# EasyEDA Pro project artisansTomePcb.eprj

# Schematic Schematic1
Create Date: 2025-06-08; Page Name: P1; Project Name: weather; Schematic Name: Schematic1; Update Date: 2025-09-30; Company: 嘉立创EDA; Page Size: A4; Version: V1.0
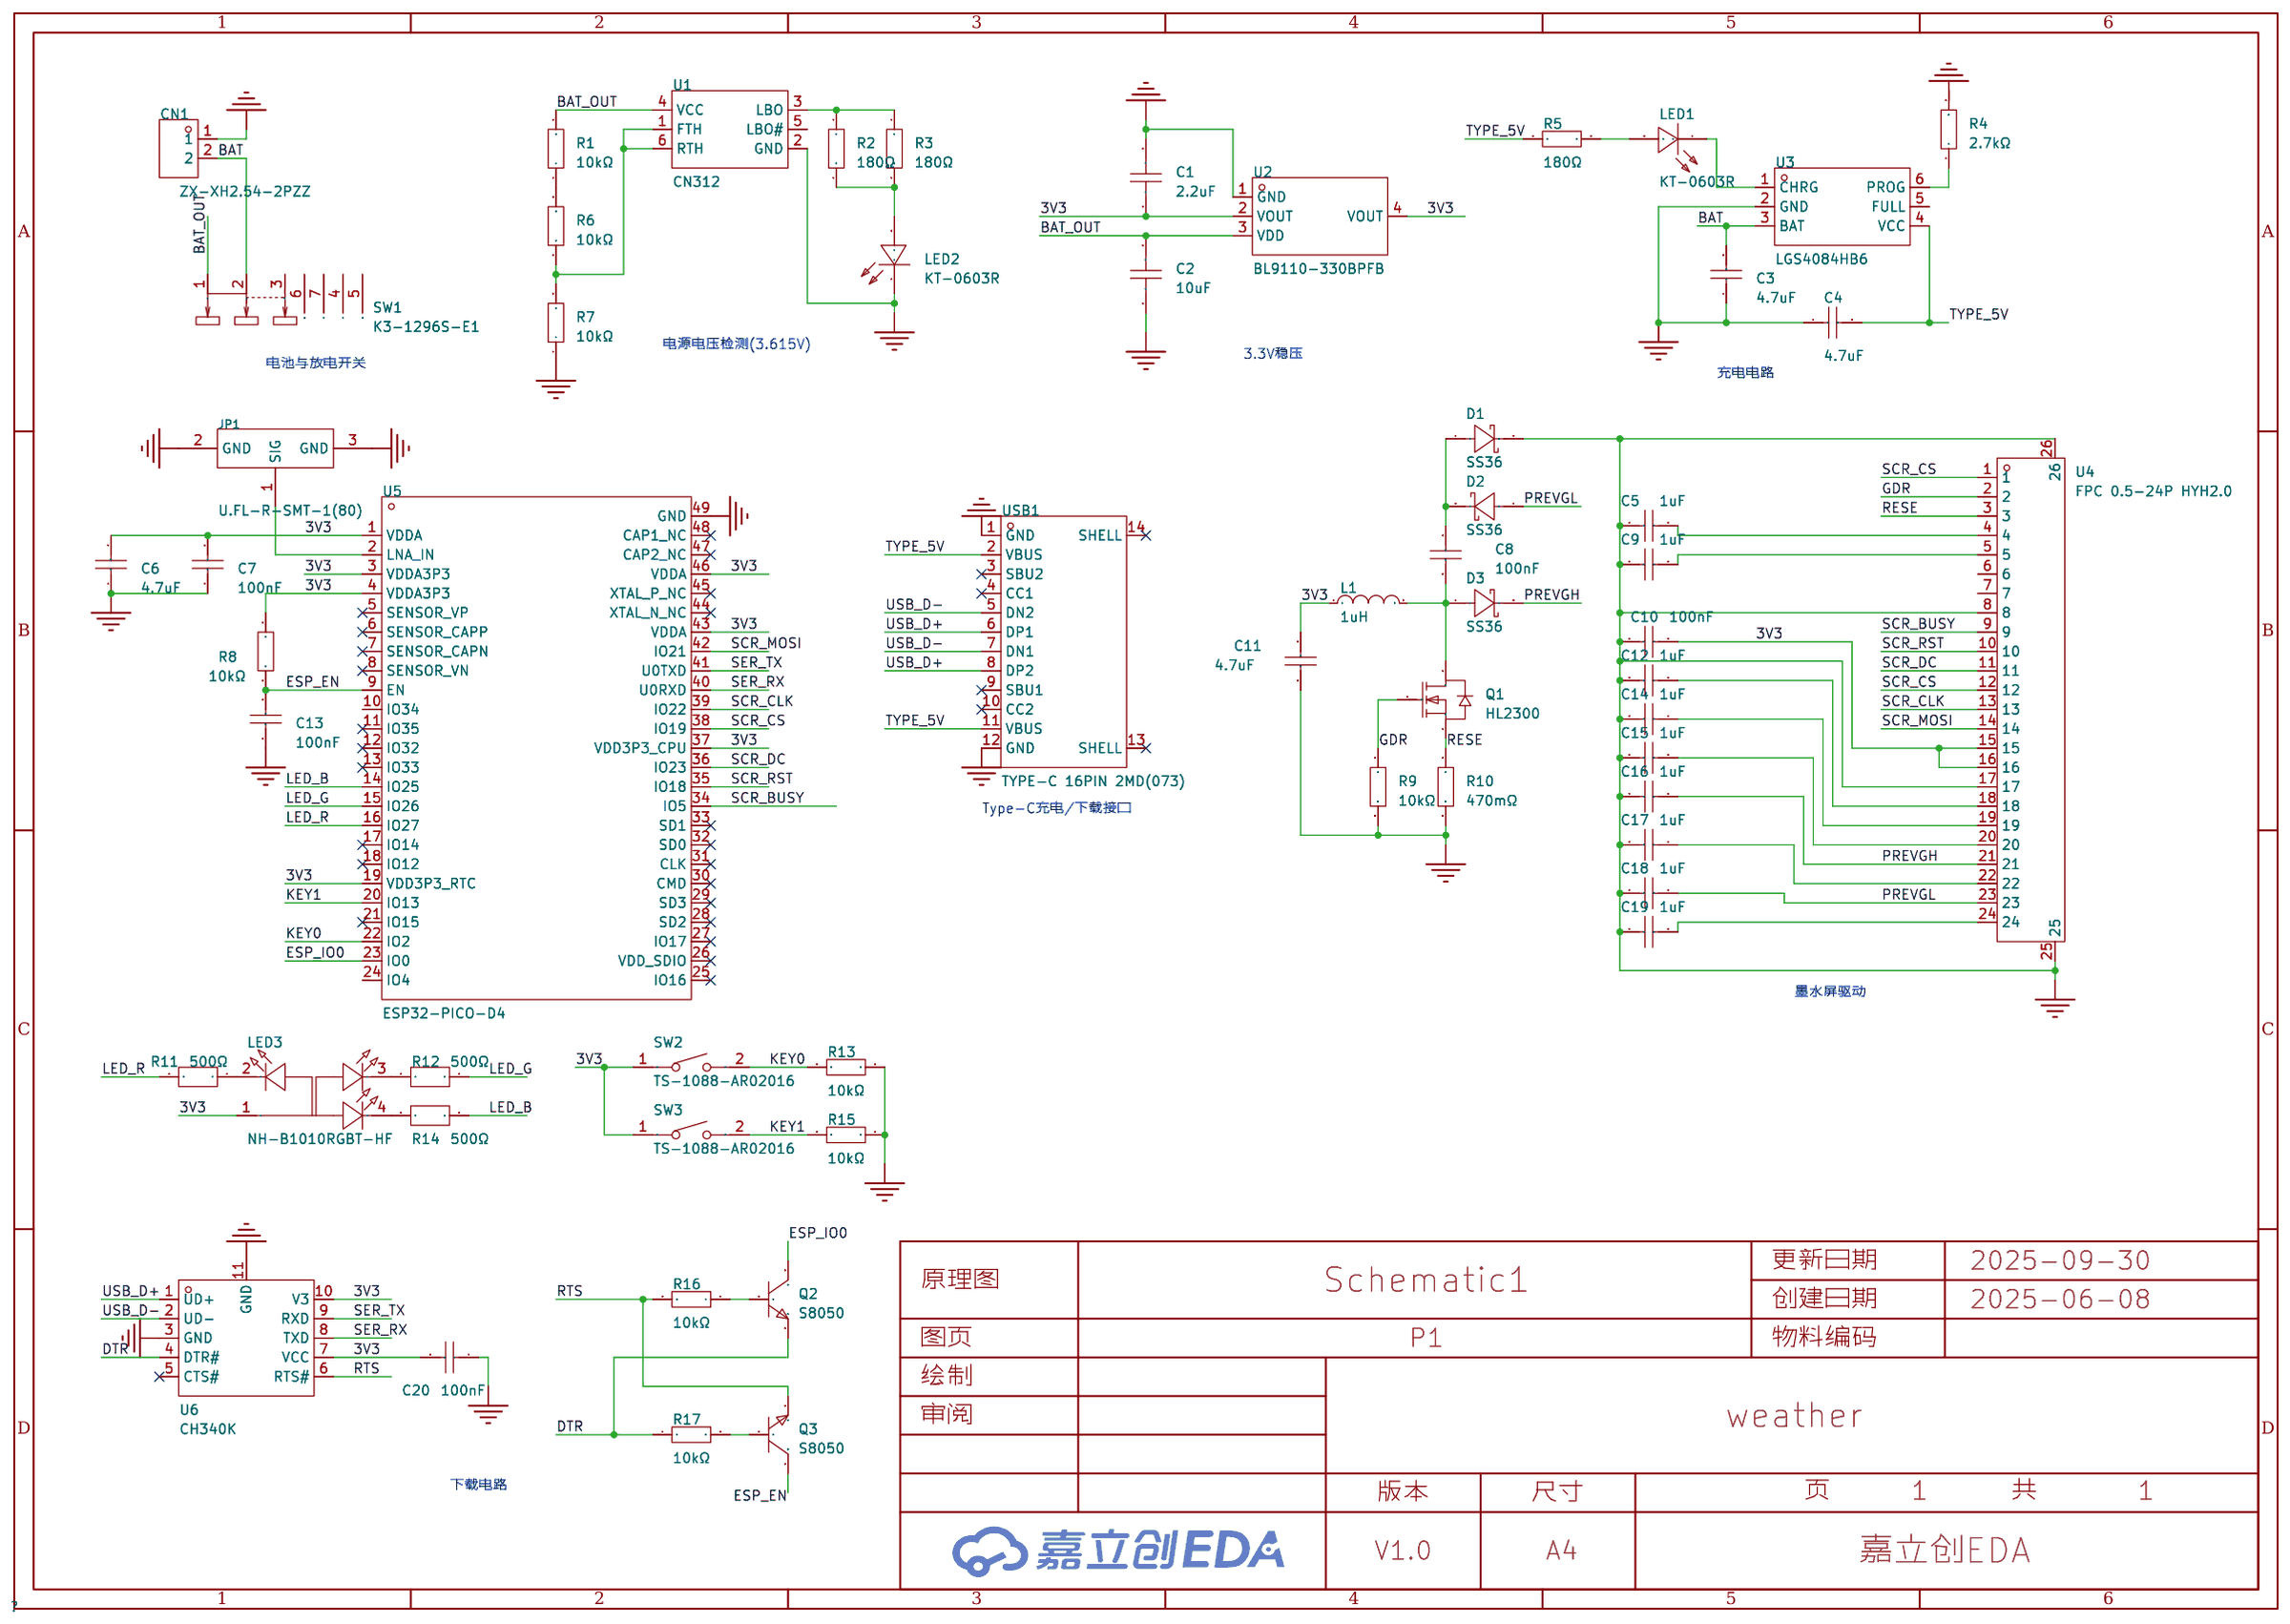
[diagram p0: schematic sheet]

## Parts
C1  2.2uF  [C0402]
C2  10uF  [C0402]
C3  4.7uF  [C0402]
C4  4.7uF  [C0402]
C5  1uF  [C0402]
C6  4.7uF  [C0402]
C7  100nF  [C0402]
C8  100nF  [C0402]
C9  1uF  [C0402]
C10  100nF  [C0402]
C11  4.7uF  [C0402]
C12  1uF  [C0402]
C13  100nF  [C0402]
C14  1uF  [C0402]
C15  1uF  [C0402]
C16  1uF  [C0402]
C17  1uF  [C0402]
C18  1uF  [C0402]
C19  1uF  [C0402]
C20  100nF  [C0402]
CN1  ZX-XH2.54-2PZZ  [CONN-TH_2P-P2.50_HX25003-2A]
D1  SS36  [DO-214AC_L5.0-W2.5-LS5.0-FD]
D2  SS36  [DO-214AC_L5.0-W2.5-LS5.0-FD]
D3  SS36  [DO-214AC_L5.0-W2.5-LS5.0-FD]
JP1  U.FL-R-SMT-1(80)  [RF-SMD_FRF05002-JSS103M]
L1  1uH  [IND-SMD_L2.0-W1.6-B]
LED1  KT-0603R  [LED0603-RD]
LED2  KT-0603R  [LED0603-RD]
LED3  NH-B1010RGBT-HF  [LED-ARRAY-SMD_4P-L1.0-W1.0-TR_NH-B1010RGBT]
Q1  HL2300  [SOT-23-3_L2.9-W1.3-P1.90-LS2.4-BR]
Q2  S8050  [SOT-23-3_L2.9-W1.6-P1.90-LS2.8-BR]
Q3  S8050  [SOT-23-3_L2.9-W1.6-P1.90-LS2.8-BR]
R1  10kΩ  [R0402]
R2  180Ω  [R0402]
R3  180Ω  [R0402]
R4  2.7kΩ  [R0402]
R5  180Ω  [R0402]
R6  10kΩ  [R0402]
R7  10kΩ  [R0402]
R8  10kΩ  [R0402]
R9  10kΩ  [R0402]
R10  470mΩ  [R0402]
R11  500Ω  [R0402]
R12  500Ω  [R0402]
R13  10kΩ  [R0402]
R14  500Ω  [R0402]
R15  10kΩ  [R0402]
R16  10kΩ  [R0402]
R17  10kΩ  [R0402]
SW1  K3-1296S-E1  [SW-TH_K3-1296S-E1]
SW2  TS-1088-AR02016  [SW-SMD_L3.9-W3.0-P4.45]
SW3  TS-1088-AR02016  [SW-SMD_L3.9-W3.0-P4.45]
U1  CN312  [SOT-23-6_L2.9-W1.6-P0.95-LS2.8-BL]
U2  BL9110-330BPFB  [SOT-223_L6.5-W3.5-P2.30-LS7.0-BR]
U3  LGS4084HB6  [SOT-23-6_L2.9-W1.6-P0.95-LS2.8-BL]
U4  FPC 0.5-24P HYH2.0  [FPC-SMD_24P-P0.50_FPC-0.5-24P-HYH2.0]
U5  ESP32-PICO-D4  [ESP32-PICO-D4_lengthen]
U6  CH340K  [ESOP-10_L4.9-W3.9-P1.00-LS6.0-BL-EP]
USB1  TYPE-C 16PIN 2MD(073)  [USB-C-SMD_TYPE-C-6PIN-2MD-073]

## Library data of the parts
C1 = HGC0402R5225K160NTEJ: 容值:2.2uF;精度:±10%;额定电压:16V;材质(温度系数):X5R;; LCSC Part Name: 2.2uF ±10% 16V; Supplier Part: C7432763; Manufacturer: Chinocera(华瓷); Supplier Footprint: 0402; JLCPCB Part Class: Extended Part; Datasheet: https://atta.szlcsc.com/upload/public/pdf/source/20240320/FAC3FEC40A78BC5CCCE96C232A94D860.pdf; Supplier: LCSC; Tolerance: ±10%; Voltage Rated: 16V; Temperature Coefficient: X5R
C2 = CGA0402X5R106M100GT: 容值:10uF;精度:±20%;额定电压:10V;材质(温度系数):X5R;; LCSC Part Name: 10uF ±20% 10V; Supplier Part: C6119763; Manufacturer: HRE(芯声); Supplier Footprint: 0402; JLCPCB Part Class: Extended Part; Supplier: LCSC; Tolerance: ±20%; Voltage Rated: 10V; Temperature Coefficient: X5R
C3 C4 C6 = CL05A106MQ5NUNC: 容值:10uF;精度:±20%;额定电压:6.3V;材质(温度系数):X5R;; LCSC Part Name: 10uF ±20% 6.3V; Supplier Part: C23733; Manufacturer: SAMSUNG(三星); Manufacturer Part: CL05A475MP5NRNC; Supplier Footprint: 0402; JLCPCB Part Class: Basic Part; Datasheet: https://atta.szlcsc.com/upload/public/pdf/source/20220823/2B02EE04F8F211D38A52DCB16EB6BEBA.pdf; Supplier: LCSC; Tolerance: ±20%; Voltage Rated: 6.3V; Temperature Coefficient: X5R
C5 C9 C12 C14-C19 = CL05A105KP5NNNC: 容值:1uF;精度:±10%;额定电压:10V;温度系数:X5R;; LCSC Part Name: 1uF ±10% 10V; Supplier Part: C14445; Manufacturer: SAMSUNG(三星); Manufacturer Part: CL05A106MQ5NUNC; Supplier Footprint: 0402; JLCPCB Part Class: Basic Part; Datasheet: https://item.szlcsc.com/datasheet/CL05A105KP5NNNC/15107.html; Supplier: LCSC; Tolerance: ±10%; Voltage Rating: 10V; Temperature Coefficient: X5R; Voltage Rated: 6.3V
C7 C10 C13 C20 = CL05B104KO5NNNC: 容值:100nF;精度:±10%;额定电压:16V;材质(温度系数):X7R;; LCSC Part Name: 100nF ±10% 16V; Supplier Part: C1525; Manufacturer: SAMSUNG(三星); Supplier Footprint: 0402; JLCPCB Part Class: Basic Part; Datasheet: https://atta.szlcsc.com/upload/public/pdf/source/20160218/1457707763339.pdf; Supplier: LCSC; Tolerance: ±10%; Voltage Rated: 16V; Temperature Coefficient: X7R
C8 = CL05B104KO5NNNC: 容值:100nF;精度:±10%;额定电压:16V;温度系数:X7R;; LCSC Part Name: 100nF ±10% 16V; Supplier Part: C1525; Manufacturer: SAMSUNG(三星); Manufacturer Part: CL05A106MQ5NUNC; Supplier Footprint: 0402; JLCPCB Part Class: Basic Part; Datasheet: https://item.szlcsc.com/datasheet/CL05B104KO5NNNC/1877.html; Supplier: LCSC; Tolerance: ±10%; Voltage Rated: 6.3V; Temperature Coefficient: X7R; Voltage Rating: 16V
C11 = CL05A475MP5NRNC: 容值:4.7uF;精度:±20%;额定电压:10V;温度系数:X5R;; LCSC Part Name: 4.7uF ±20% 10V; Supplier Part: C23733; Manufacturer: SAMSUNG(三星); Supplier Footprint: 0402; JLCPCB Part Class: Basic Part; Datasheet: https://item.szlcsc.com/datasheet/CL05A475MP5NRNC/24469.html; Supplier: LCSC; Tolerance: ±20%; Voltage Rating: 10V; Temperature Coefficient: X5R; Voltage Rated: 6.3V
CN1 = ZX-XH2.54-2PZZ: 插针结构:1x2P;间距:2.54mm;安装方式:直插;参考系列:XH;总PIN数:2P;排数:1;每排PIN数:2;行距:-;额定电流:3A;触头材质:黄铜;触头镀层:锡;工作温度范围:-25℃~+85℃;; Supplier Part: C7429632; Manufacturer: Megastar(兆星); Supplier Footprint: 插件,P=2.54mm; JLCPCB Part Class: Extended Part; Datasheet: https://atta.szlcsc.com/upload/public/pdf/source/20230619/19BA6947230AA44A04D3EDD65E618FD0.pdf; Supplier: LCSC; Pins Structure: 1x2P; Pitch: 2.54mm; Mounting Style: 直插; Reference Series: XH; Number of Pins: 2P; Number of Rows: 1; Number of PINs Per Row: 2; Current Rating (Max): 3A; Contact Material: 黄铜; Contact Plating: 锡; Operating Temperature Range: -25℃~+85℃
D1-D3 = SS36_C7420367: 二极管配置:独立式;正向压降(Vf):700mV@3.0A;直流反向耐压(Vr):60V;整流电流:3A;; LCSC Part Name: 电压:60V 电流:3A; Supplier Part: C7420367; Manufacturer: R+O(宏嘉诚); Supplier Footprint: SMA(DO-214AC); JLCPCB Part Class: Extended Part; Datasheet: https://item.szlcsc.com/datasheet/SS36/8397189.html; Supplier: LCSC; Diode Configuration: 独立式; Forward Voltage (Vf@If): 700mV@3.0A; Reverse Voltage (Vr): 60V; Rectified Current: 3A; Reverse Leakage Current (Ir): 10mA@60V; Voltage - Forward(Vf@If): 700mV@3.0A; Voltage - DC Reverse(Vr): 60V; Current - Rectified: 3A; Operating Junction Temperature Range: -55℃~+150℃; Non-Repetitive Peak Forward Surge Current: 80A
JP1 = U.FL-R-SMT-1(80)_C88374: 连接器类型:板端;接口类型:内针;端口数量:1;接口直径:2mm;接口长度/高度:1.25mm;频率-最大值:6GHz;射频系列:IPEX;阻抗:50Ω;样式:-;触头材质:黄铜;工作温度范围:-40℃~+90℃;; LCSC Part Name: IPEX 内针; Supplier Part: C88374; Manufacturer: HRS(广濑); Supplier Footprint: SMD; JLCPCB Part Class: Extended Part; Datasheet: https://atta.szlcsc.com/upload/public/pdf/source/20161125/1480067868647.pdf; Supplier: LCSC; Connector Type: 板端; Interface Type: 内针; Number of Ports: 1; Interface Diameter: 2mm; Interface Length/Height: 1.25mm; Frequency-Max: 6GHz; RF Series: IPEX; Impedance: 50Ω; Contact Material: 黄铜; Operating Temperature Range: -40℃~+90℃
L1 = FTC201610S1R0MBCA: 电感值:1uH;精度:±20%;额定电流:4.5A;饱和电流(Isat):4.6A;类型:一体成型电感;; LCSC Part Name: 1uH ±20% 4.6A; Supplier Part: C5832342; Manufacturer: cjiang(长江微电); Supplier Footprint: SMD,1.6x2mm; JLCPCB Part Class: Extended Part; Datasheet: https://atta.szlcsc.com/upload/public/pdf/source/20230602/8FFEDA9C0247A92A0D4B67554BFE4091.pdf; Supplier: LCSC; Tolerance: ±20%; Rated Current: 4.5A; Saturation Current (Isat): 4.6A; DC Resistance (DCR): 35mΩ; Type: 一体成型电感
LED1 LED2 = KT-0603R: 发光颜色:红色;功率:-;正向电流:-;主波长:-;二极管配置:-;透镜颜色:-;色温:-;发光角度:-;载带方式:-;工作温度:-40℃~+85℃;; LCSC Part Name: 0603 红灯 高亮; Supplier Part: C2286; Manufacturer: KENTO; Supplier Footprint: 0603; JLCPCB Part Class: Basic Part; Datasheet: https://atta.szlcsc.com/upload/public/pdf/source/20160616/1466072038404.pdf; Supplier: LCSC; Emitted Color: 红色; Operating Temperature: -40℃~+85℃
LED3 = NH-B1010RGBT-HF: 户内RGB，全黑框架，对比度高，黑色哑光封装，无镜面反射; LCSC Part Name: 贴片全彩LED; Supplier Part: C2874113; Manufacturer: 国星光电; Supplier Footprint: SMD-4P,1x1mm; JLCPCB Part Class: Extended Part; Datasheet: https://item.szlcsc.com/datasheet/NH-B1010RGBT-HF/3078825.html; Supplier: LCSC; Diode Configuration: 共阳极; Wavelength - Dominant: R:620nm；G:530nm；B:470nm; Luminous Intensity: R:18mcd；G:25mcd；B:4.5mcd; Viewing Angle: 120°; Forward Current: B:2mA；G:2mA；R:5mA; Forward Voltage(Vf): R:2V；G:2.6V；B:2.7V; Installation Method: 正贴; Operating Temperature: -30℃~+85℃
Q1 = HL2300_C7420343: 数量:1个N沟道;漏源电压(Vdss):20V;连续漏极电流(Id):4.5A;导通电阻(RDS(on)):20mΩ@4.5V;耗散功率(Pd):1W;阈值电压(Vgs(th)):600mV@250uA;; LCSC Part Name: N沟道,电流:4.5A,耐压:20V; Supplier Part: C7420343; Manufacturer: R+O(宏嘉诚); Supplier Footprint: SOT-23; JLCPCB Part Class: Extended Part; Datasheet: https://item.szlcsc.com/datasheet/HL2300/8397165.html; Supplier: LCSC; Number: 1个N沟道; Drain to Source Voltage: 20V; Current - Continuous Drain(Id): 4.5A; RDS(on): 20mΩ@4.5V; Pd - Power Dissipation: 1W; Gate Threshold Voltage (Vgs(th)): 600mV@250uA; Gate Charge(Qg): 6.06nC@4.5V; Input Capacitance(Ciss): 418pF; Reverse Transfer Capacitance (Crss@Vds): 70pF; Operating Temperature: -55℃~+150℃; Type: N沟道; Output Capacitance(Coss): 82pF
Q2 Q3 = S8050_C181158: 晶体管类型:NPN;集电极电流(Ic):500mA;集射极击穿电压(Vceo):25V;功率(Pd):300mW;; LCSC Part Name: NPN 电流:500mA 耐压:25V; Supplier Part: C181158; Manufacturer: Hottech(合科泰); Supplier Footprint: SOT-23; JLCPCB Part Class: Extended Part; Datasheet: https://atta.szlcsc.com/upload/public/pdf/source/20220506/D987F39D56F2975D34EC7947E75C4ABC.pdf; Supplier: LCSC; Transistor Type: NPN; Collector Current (Ic): 500mA; Collector-Emitter Breakdown Voltage (Vceo): 25V; Power Dissipation (Pd): 300mW; Transition Frequency (fT): 150MHz; Collector Cut-Off Current (Icbo): 100nA; Collector-Emitter Saturation Voltage (VCE(sat)@Ic,Ib): 600mV@500mA,50mA
R1 R6 R7 = 0402WGF1003TCE: 电阻类型:厚膜电阻;阻值:100kΩ;精度:±1%;功率:62.5mW;工作电压:50V;温度系数:±100ppm/℃;; LCSC Part Name: 100kΩ ±1% 62.5mW 厚膜电阻; Supplier Part: C25744; Manufacturer: UNI-ROYAL(厚声); Manufacturer Part: 0402WGF1002TCE; Supplier Footprint: 0402; JLCPCB Part Class: Basic Part; Datasheet: https://item.szlcsc.com/datasheet/0402WGF1003TCE/26484.html; Supplier: LCSC; Type: 厚膜电阻; Tolerance: ±1%; Power(Watts): 62.5mW; Voltage-Supply(Max): 50V; Temperature Coefficient: ±100ppm/℃; Operating Temperature: -55℃~+155℃; Overload Voltage (Max): 50V; Operating Temperature Range: -55℃~+155℃
R2 R3 R5 = 0402WGF1800TCE: 电阻类型:厚膜电阻;阻值:180Ω;精度:±1%;功率:62.5mW;最大工作电压:50V;温度系数:±100ppm/℃;; LCSC Part Name: 180Ω ±1% 62.5mW 厚膜电阻; Supplier Part: C38941; Manufacturer: UNI-ROYAL(厚声); Supplier Footprint: 0402; JLCPCB Part Class: Extended Part; Datasheet: https://atta.szlcsc.com/upload/public/pdf/source/20200306/C422600_1E6D84923E4A46A82E41ADD87F860B5C.pdf; Supplier: LCSC; Type: 厚膜电阻; Tolerance: ±1%; Power(Watts): 62.5mW; Overload Voltage (Max): 50V; Temperature Coefficient: ±100ppm/℃; Operating Temperature Range: -55℃~+155℃
R4 = 0402WGF2701TCE: 电阻类型:厚膜电阻;阻值:2.7kΩ;精度:±1%;功率:62.5mW;最大工作电压:50V;温度系数:±100ppm/℃;; LCSC Part Name: 2.7kΩ ±1% 62.5mW 厚膜电阻; Supplier Part: C25885; Manufacturer: UNI-ROYAL(厚声); Supplier Footprint: 0402; JLCPCB Part Class: Extended Part; Datasheet: https://atta.szlcsc.com/upload/public/pdf/source/20200306/C422600_1E6D84923E4A46A82E41ADD87F860B5C.pdf; Supplier: LCSC; Type: 厚膜电阻; Tolerance: ±1%; Power(Watts): 62.5mW; Overload Voltage (Max): 50V; Temperature Coefficient: ±100ppm/℃; Operating Temperature Range: -55℃~+155℃
R8 R13 R15-R17 = 0402WGF1002TCE: 电阻类型:厚膜电阻;阻值:10kΩ;精度:±1%;功率:62.5mW;最大工作电压:50V;温度系数:±100ppm/℃;; LCSC Part Name: 10kΩ ±1% 62.5mW 厚膜电阻; Supplier Part: C25744; Manufacturer: UNI-ROYAL(厚声); Supplier Footprint: 0402; JLCPCB Part Class: Basic Part; Datasheet: https://atta.szlcsc.com/upload/public/pdf/source/20200306/C422600_1E6D84923E4A46A82E41ADD87F860B5C.pdf; Supplier: LCSC; Type: 厚膜电阻; Tolerance: ±1%; Power(Watts): 62.5mW; Overload Voltage (Max): 50V; Temperature Coefficient: ±100ppm/℃; Operating Temperature Range: -55℃~+155℃
R9 = 0402WGF1002TCE: 电阻类型:厚膜电阻;阻值:10kΩ;精度:±1%;功率:62.5mW;工作电压:50V;温度系数:±100ppm/℃;; LCSC Part Name: 10kΩ ±1% 62.5mW 厚膜电阻; Supplier Part: C25744; Manufacturer: UNI-ROYAL(厚声); Supplier Footprint: 0402; JLCPCB Part Class: Basic Part; Datasheet: https://item.szlcsc.com/datasheet/0402WGF1002TCE/26487.html; Supplier: LCSC; Type: 厚膜电阻; Tolerance: ±1%; Power(Watts): 62.5mW; Overload Voltage (Max): 50V; Temperature Coefficient: ±100ppm/℃; Operating Temperature Range: -55℃~+155℃; Voltage-Supply(Max): 50V; Operating Temperature: -55℃~+155℃
R10 = 0402WGF470LTCE: 电阻类型:厚膜电阻;阻值:470mΩ;精度:±1%;功率:62.5mW;最大工作电压:50V;; LCSC Part Name: 470mΩ ±1% 62.5mW 厚膜电阻; Supplier Part: C423162; Manufacturer: UNI-ROYAL(厚声); Supplier Footprint: 0402; JLCPCB Part Class: Extended Part; Datasheet: https://atta.szlcsc.com/upload/public/pdf/source/20200306/C422600_1E6D84923E4A46A82E41ADD87F860B5C.pdf; Supplier: LCSC; Type: 厚膜电阻; Tolerance: ±1%; Power(Watts): 62.5mW; Overload Voltage (Max): 50V; Operating Temperature Range: -55℃~+155℃; Temperature Coefficient: ±100ppm/℃
R11 R12 R14 = RT0402FRE07500RL: 电阻类型:薄膜电阻;阻值:500Ω;精度:±1%;功率:63mW;温度系数:±50ppm/℃;; LCSC Part Name: 薄膜电阻 500Ω ±1% 63mW; Supplier Part: C6460545; Manufacturer: YAGEO(国巨); Supplier Footprint: 0402; JLCPCB Part Class: Extended Part; Datasheet: https://item.szlcsc.com/datasheet/RT0402FRE07500RL/7413722.html; Supplier: LCSC; Type: 薄膜电阻; Tolerance: ±1%; Power(Watts): 63mW; Temperature Coefficient: ±50ppm/℃; Operating Temperature: -55℃~+155℃
SW1 = K3-1296S-E1: 电路结构:单刀双掷;安装方式:卧贴;开关颜色:黑色;额定电流(DC):300mA;额定电压(DC):4V;额定电流(AC):-;额定电压(AC):-;机械寿命:1万次;; LCSC Part Name: 卧贴双档 滑动开关; Supplier Part: C128955; Manufacturer: 韩国韩荣; Supplier Footprint: SMD; JLCPCB Part Class: Extended Part; Datasheet: https://atta.szlcsc.com/upload/public/pdf/source/20210810/891A308926761427C641228111E8C4D0.pdf; Supplier: LCSC; Circuit: 单刀双掷; Actuator Style: 矩形柱状; Pin Style: SMD接片; Switch Length: 6.6mm; Switch Width: 2.7mm; Switch Height: 1.4mm; Mounting Style: 卧贴; Actuator Color: 黑色; Current Rating (DC): 300mA; Voltage Rating (DC): 4V; Mechanical Life: 1万次; Operating Temperature: -25℃~+80℃
SW2 SW3 = TS-1088-AR02016: 电路结构:单刀单掷;按钮形状:圆形按钮;作用力:160gf;安装方式:立贴;开关长度:4mm;开关宽度:3mm;开关高度:2mm;带支架:不带;触点电流:50mA;额定电压(DC):12V;绝缘电阻:100MΩ;机械寿命:10万次;; LCSC Part Name: 4*3*2mm 立贴 轻触开关; Supplier Part: C720477; Manufacturer: XUNPU(讯普); Supplier Footprint: SMD; JLCPCB Part Class: Extended Part; Datasheet: https://atta.szlcsc.com/upload/public/pdf/source/20200810/C720475_60D09DD6C54279ADDB2DC25100F1CC11.pdf; Supplier: LCSC; Circuit: 单刀单掷; Actuator Style: 圆形按钮; Operating Force: 160gf; Mounting Style: 立贴; Switch Length: 4mm; Switch Width: 3mm; Switch Height: 2mm; Strike Gundam: 不带; Contact Current: 50mA; Voltage Rating (DC): 12V; Insulation Resistance: 100MΩ; Actuator/Cap Color: 黑色; Pin Style: SMD接片; Mechanical Life: 10万次; Operating Temperature: -30℃~+80℃
U1 = CN312: 集成电路; Supplier Part: C7495114; Manufacturer: CONSONANCE(上海如韵); Supplier Footprint: SOT-23-6L; JLCPCB Part Class: Extended Part; Datasheet: https://atta.szlcsc.com/upload/public/pdf/source/20230915/A8641F2176FA560F6A2DB41CB2D84827.pdf; Supplier: LCSC
U2 = BL9110-330BPFB: 输出类型:固定;最大输入电压:6V;输出电压:3.3V;最大输出电流:1A;电源纹波抑制比(PSRR):70dB@(1kHz);输出极性:正极;; LCSC Part Name: 输入6V 输出3.3V 1A; Supplier Part: C169246; Manufacturer: BL(上海贝岭); Supplier Footprint: SOT-223; JLCPCB Part Class: Extended Part; Datasheet: https://atta.szlcsc.com/upload/public/pdf/source/20180705/C248270_2CFF879E361E2024221F82A6F237DEBB.pdf; Supplier: LCSC; Output Type: 固定; Maximum Input Voltage: 6V; Output Voltage: 3.3V; MAX Output Current: 1A; Power Supply Rejection Ratio (PSRR): 70dB@(1kHz); Dropout Voltage: 390mV@(1A); Output Polarity: 正极; Number of Outputs: 1
U3 = LGS4084HB6: 电源电压:4V~6V;最大充电电流:500mA;电池类型:锂离子/聚合物;电池节数:1;; LCSC Part Name: 单节锂电池充电 高压4054(SOT23-6); Supplier Part: C5299901; Manufacturer: Legend-Si(棱晶半导体); Supplier Footprint: SOT-23-6; JLCPCB Part Class: Extended Part; Datasheet: https://atta.szlcsc.com/upload/public/pdf/source/20230407/94D9C0552C6EF587CC76B9FFE17BDA56.pdf; Supplier: LCSC; The Chip Type: 线性充电芯片; Supply Voltage: 4V~6V; Maximum Charge Current: 500mA; Charging Saturation Voltage: 4.2V; Type of Battery: 锂离子/聚合物; Number of Cells: 1; Operating Temperature: -40℃~+125℃
U4 = FPC 0.5-24P HYH2.0: 锁定特性:翻盖式;触点类型:双侧触点/上下接;触点数量:24P;间距:0.5mm;安装方式:卧贴;工作温度:-25℃~+85℃;; LCSC Part Name: 翻盖式 双侧触点/上下接 P数:24P 间距:0.5mm; Supplier Part: C6364666; Manufacturer: SHOU HAN(首韩); Supplier Footprint: SMD,P=0.5mm,卧贴; JLCPCB Part Class: Extended Part; Datasheet: https://item.szlcsc.com/datasheet/FPC%25200.5-24P%2520HYH2.0/7314068.html; Supplier: LCSC; Locking Feature: 翻盖式; Contact Type: 双侧触点/上下接; Number of Contacts: 24P; Pitch: 0.5mm; Mounting Type: 卧贴; Height Above Board: 2mm; Contact Material: 铜; Contact Plating: 锡; Operating Temperature: -25℃~+85℃
U5 = ESP32-PICO-D4: 频率范围:2.4GHz~2.5GHz;接口:ADC, SDIO, SPI, PWM, UART, I2C, I2S, GPIO;应用领域:蓝牙,WiFi;数据速率:-;灵敏度:-;典型应用频率:-;; LCSC Part Name: 集成2.4GHz WIFI和蓝牙的模组; Supplier Part: C193707; Manufacturer: ESPRESSIF(乐鑫); Supplier Footprint: QFN-48-EP(7x7); JLCPCB Part Class: Extended Part; Datasheet: https://atta.szlcsc.com/upload/public/pdf/source/20180531/C193707_20E6BADDB6EC95F0C0D505BA515D2866.pdf; Supplier: LCSC; Frequency Range: 2.4GHz~2.5GHz; Interface: ADC, SDIO, SPI, PWM, UART, I2C, I2S, GPIO; Operating Voltage: 2.7V~3.6V; Applications: 蓝牙,WiFi; Operating Temperature: -40℃~+85℃
U6 = CH340K_C18208922: LCSC Part Name: CH340K 人工转编带; Supplier Part: C18208922; Manufacturer: WCH(南京沁恒); Supplier Footprint: ESSOP-10-150mil-1mm; JLCPCB Part Class: Extended Part; Datasheet: https://atta.szlcsc.com/upload/public/pdf/source/20240313/9D833A30DDFD16C064A7ADE10A944019.pdf; Supplier: LCSC
USB1 = TYPE-C 16PIN 2MD(073): 连接器类型:Type-C;标准:-;公母:母;端口数量:1;触点数量:16P;安装方式:卧贴;额定电流 - 电源:5A;工作温度范围:-25℃~+85℃;; LCSC Part Name: Type-C 母 卧贴; Supplier Part: C2765186; Manufacturer: SHOU HAN(首韩); Supplier Footprint: SMD; JLCPCB Part Class: Extended Part; Datasheet: https://atta.szlcsc.com/upload/public/pdf/source/20211123/39B17C16241EAC15C5E277BDA434118E.pdf; Supplier: LCSC; Connector Type: Type-C; Gender: 母; Number of Ports: 1; Number of Contacts: 16P; Mounting Style: 卧贴; Current Rating - Power (Max): 5A; Operating Temperature Range: -25℃~+85℃

## Nets
3V3: C1.1 C6.2 C7.2 C10.1 C11.2 C20.2 L1.1 LED3.1(+) R8.1 SW2.1 SW3.1 U2.2(VOUT) U2.4(VOUT) U4.15 U4.16 U5.1(VDDA) U5.3(VDDA3P3) U5.4(VDDA3P3) U5.19(VDD3P3_RTC) U5.37(VDD3P3_CPU) U5.43(VDDA) U5.46(VDDA) U6.7(VCC) U6.10(V3)
GND: C1.2 C2.1 C3.1 C4.1 C5.2 C6.1 C7.1 C9.2 C10.2 C11.1 C12.2 C13.1 C14.2 C15.2 C16.2 C17.2 C18.2 C19.2 C20.1 CN1.1 D1.2(K) JP1.2(GND) JP1.3(GND) LED2.1(K) R4.2 R7.1 R9.2 R10.2 R13.1 R15.1 U1.2(GND) U2.1(GND) U3.2(GND) U4.8 U4.17 U4.25 U4.26 U5.49(GND) U6.3(GND) U6.11(GND) USB1.1(GND) USB1.12(GND)
BAT: C3.2 CN1.2 SW1.2 U3.3(BAT)
BAT_OUT: C2.2 R1.2 SW1.1 U1.4(VCC) U2.3(VDD)
DTR: Q2.2 R17.1 U6.4(DTR#)
ESP_EN: C13.2 Q3.3 R8.2 U5.9(EN)
ESP_IO0: Q2.3 U5.23(IO0)
GDR: Q1.1(G) R9.1 U4.2
KEY0: R13.2 SW2.2 U5.22(IO2)
KEY1: R15.2 SW3.2 U5.20(IO13)
LED_B: R14.1 U5.14(IO25)
LED_G: R12.1 U5.15(IO26)
LED_R: R11.2 U5.16(IO27)
PREVGH: C16.1 D3.2(K) U4.21
PREVGL: C18.1 D2.1(A) U4.23
RESE: Q1.2(S) R10.1 U4.3
RTS: Q3.2 R16.2 U6.6(RTS#)
SCR_BUSY: U4.9 U5.34(IO5)
SCR_CLK: U4.13 U5.39(IO22)
SCR_CS: U4.1 U4.12 U5.38(IO19)
SCR_DC: U4.11 U5.36(IO23)
SCR_MOSI: U4.14 U5.42(IO21)
SCR_RST: U4.10 U5.35(IO18)
SER_RX: U5.40(U0RXD) U6.8(TXD)
SER_TX: U5.41(U0TXD) U6.9(RXD)
TYPE_5V: C4.2 R5.1 U3.4(VCC) USB1.2(VBUS) USB1.11(VBUS)
USB_D+: U6.1(UD+) USB1.6(DP1) USB1.8(DP2)
USB_D-: U6.2(UD-) USB1.5(DN2) USB1.7(DN1)
$1N863: JP1.1(SIG) U5.2(LNA_IN)
$1N884: Q3.1 R17.2
$1N885: Q2.1 R16.1
$1N1862: LED1.2(A) R5.2
$1N1863: LED1.1(K) U3.1(CHRG)
$1N1867: R4.1 U3.6(PROG)
$1N7637: R1.1 R6.2
$1N7673: R6.1 R7.2 U1.1(FTH) U1.6(RTH)
$1N7798: LED2.2(A) R2.2 R3.2
$1N7808: R2.1 R3.1 U1.3(LBO)
$1N8395: C5.1 U4.4
$1N8399: C9.1 U4.5
$1N8887: C19.1 U4.24
$1N8895: C12.1 U4.18
$1N8900: C14.1 U4.19
$1N8928: C15.1 U4.20
$1N8950: C17.1 U4.22
$1N9134: C8.2 D1.1(A) D2.2(K)
$1N9218: C8.1 D3.1(A) L1.2 Q1.3(D)
$1N9685: LED3.2(-) R11.1
$1N9687: LED3.4(-) R14.2
$1N9689: LED3.3(-) R12.2

Not connected (* = marked no-connect by the designer): SW1 3 4 5 6 7; U1 5(LBO#); U3 5(FULL); U4 6 7; U5 5(SENSOR_VP)* 6(SENSOR_CAPP)* 7(SENSOR_CAPN)* 8(SENSOR_VN)* 10(IO34) 11(IO35)* 12(IO32)* 13(IO33)* 17(IO14)* 18(IO12)* 21(IO15)* 24(IO4) 25(IO16)* 26(VDD_SDIO)* 27(IO17)* 28(SD2)* 29(SD3)* 30(CMD)* 31(CLK)* 32(SD0)* 33(SD1)* 44(XTAL_N_NC)* 45(XTAL_P_NC)* 47(CAP2_NC)* 48(CAP1_NC)*; U6 5(CTS#)*; USB1 3(SBU2)* 4(CC1)* 9(SBU1)* 10(CC2)* 13(SHELL)* 14(SHELL)*

## Notes on the sheet
- 电源电压检测(3.615V)
- 3.3V稳压
- 电池与放电开关
- 充电电路
- Type-C充电/下载接口
- 墨水屏驱动
- 下载电路

# Board PCB3
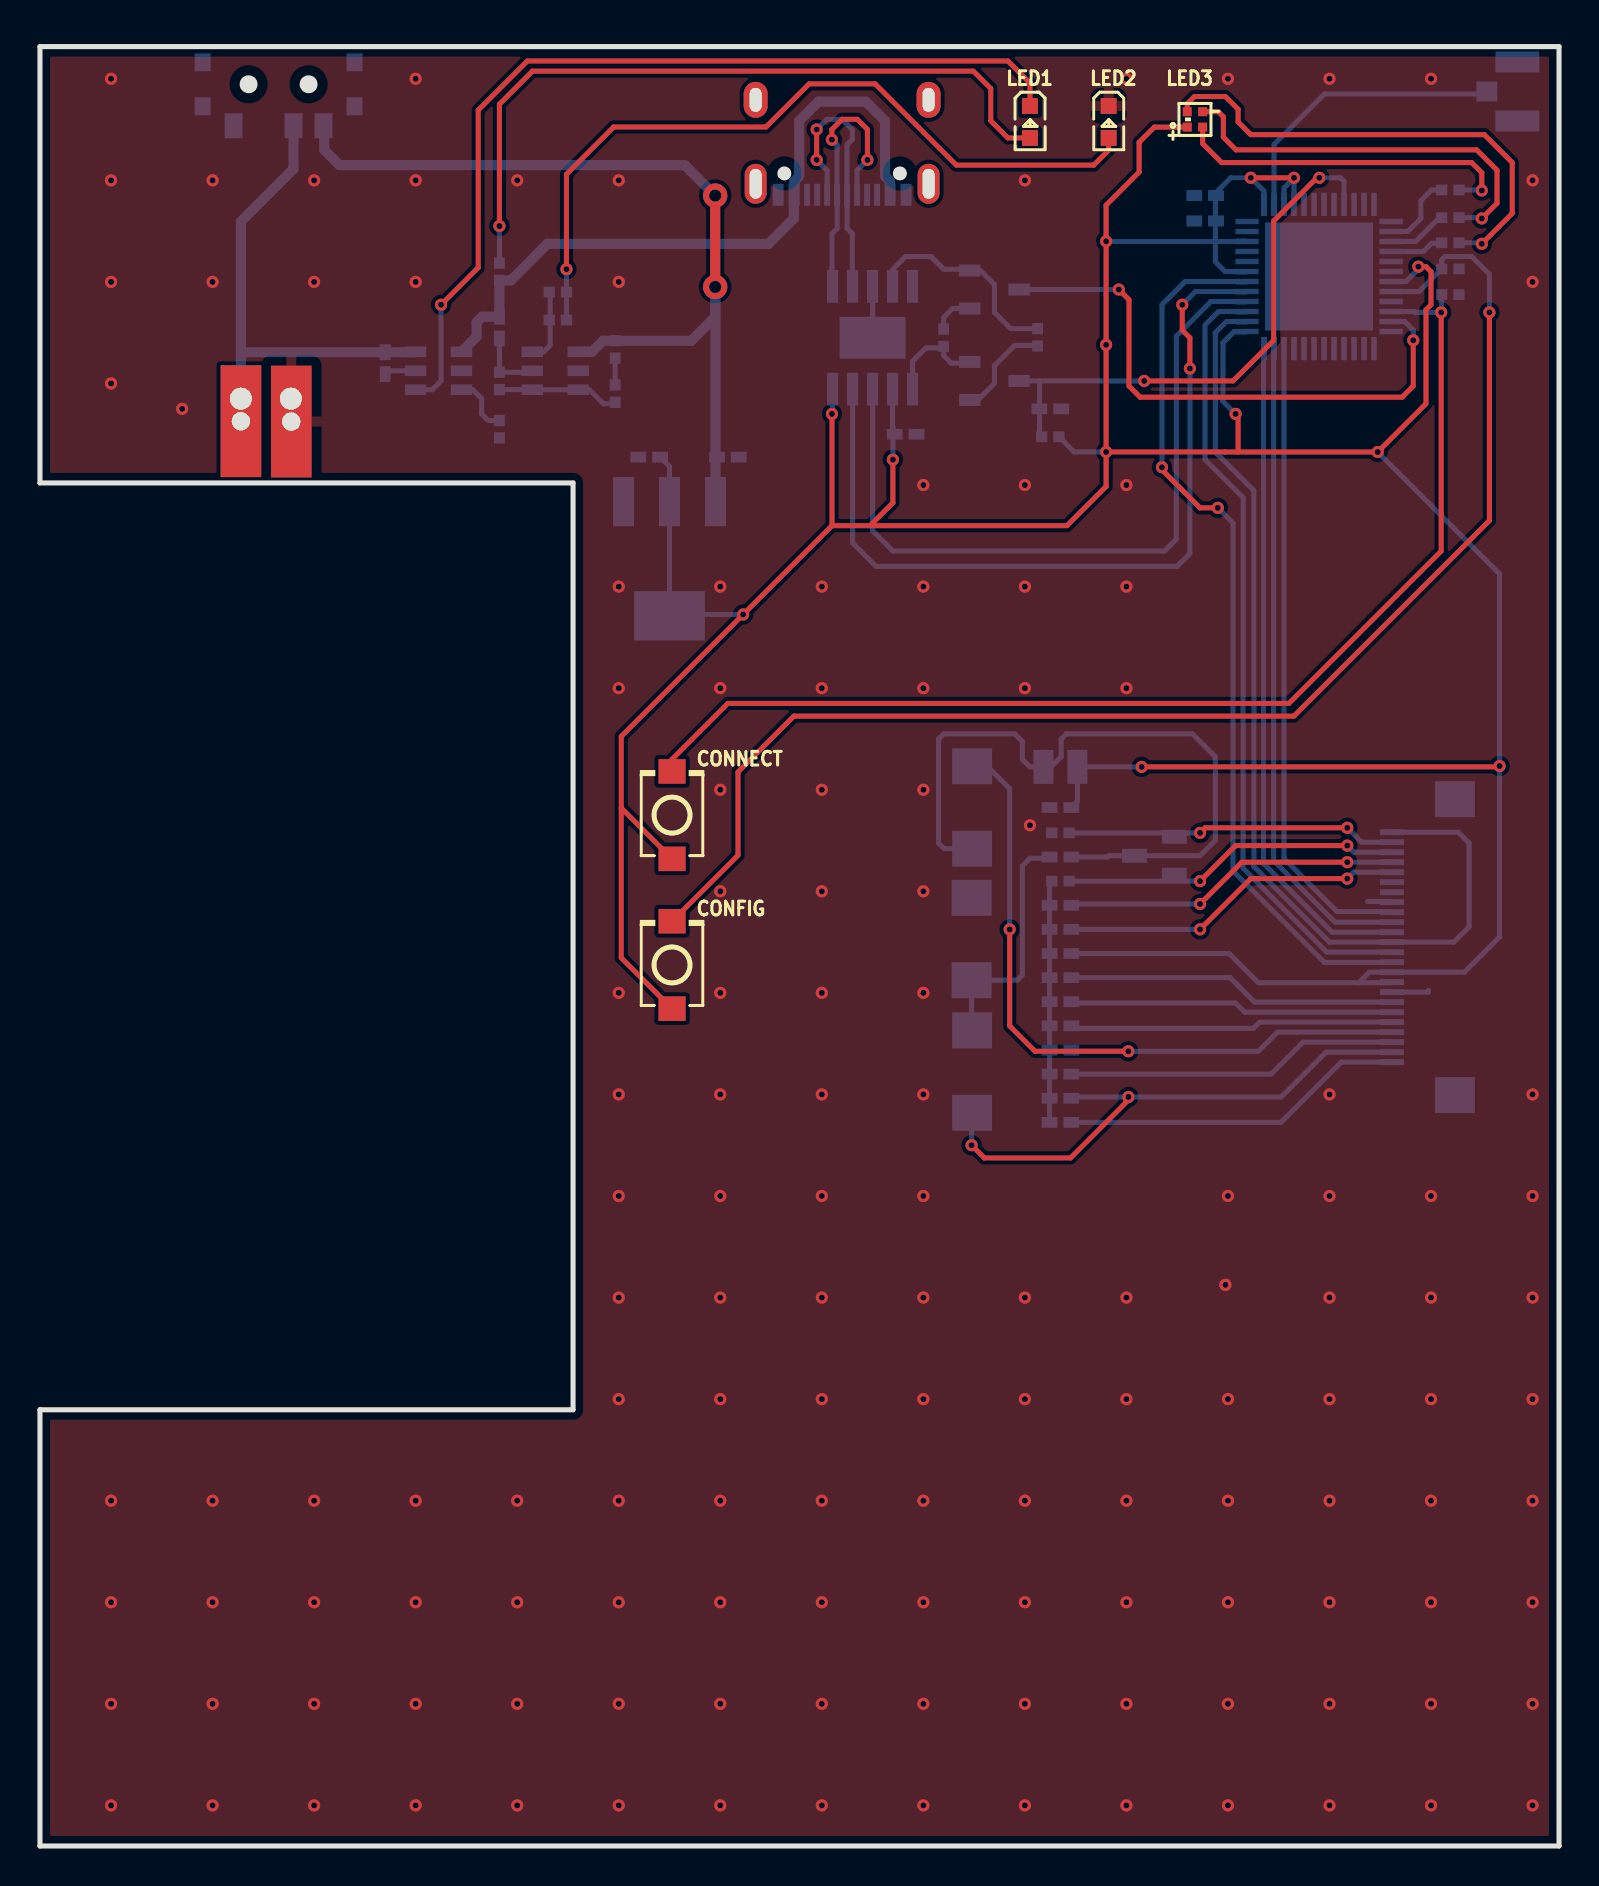
[diagram p1: board, top side]
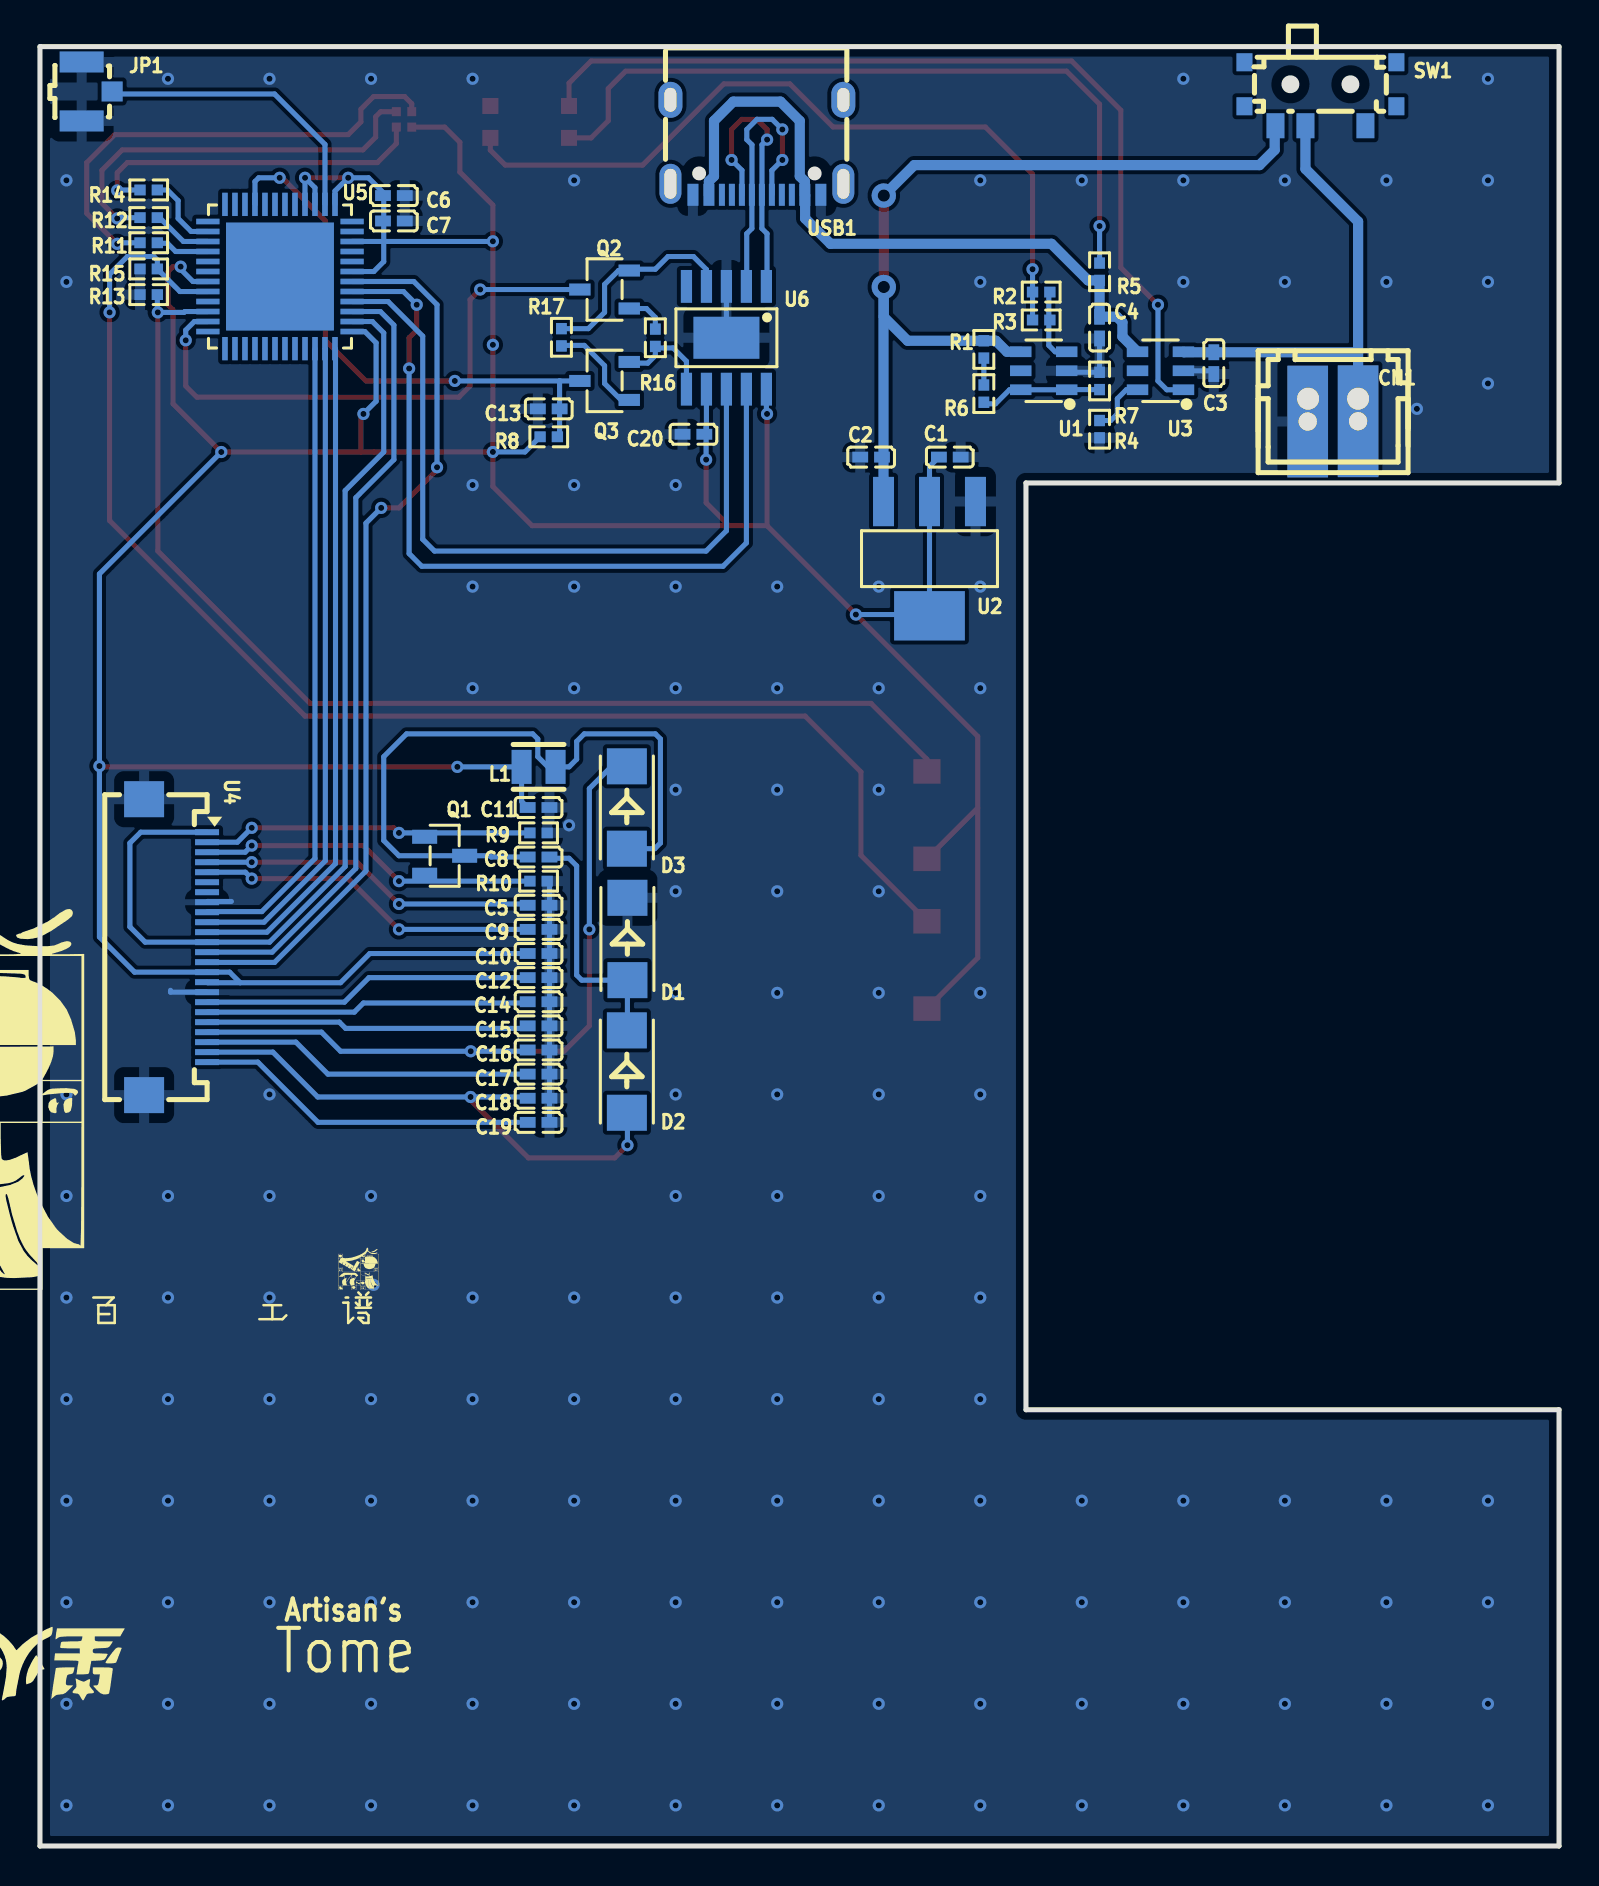
[diagram p2: board, bottom side, seen from below]

Outline 76 x 90 mm; copper layers: Top Layer, Bottom Layer. Coordinates in mm from the lower left corner of the outline.
Outline path: 0,90 0,68.18 26.67,68.18 26.67,21.82 0,21.82 0,0 76,0 76,90 0,90
Stack: Top Layer 0.035mm / Dielectric1 1.51mm FR4 er 4.5 / Bottom Layer 0.035mm

## Design rules (mm)
net USB_D+: DP1
net USB_D-: DP1
template: JLCPCB Capability(Two Layers Board)
spacing copperThickness1oz (default): track to track 0.102, other pairs 0.152 to 0.3
spacing copperThickness2oz: track to track 0.203, other pairs 0.152 to 0.3
track width copperThickness1oz (default): min 0.127, default 0.254, max 2.54
track width copperThickness2oz: min 0.203, default 0.254, max 2.54
differential pair differentialPair (default): width min 0.127, default 0.254, max 2.54; gap min 0.152, default 0.152
via viaSize (default): diameter min 0.5, default 0.61, max 10; hole min 0.3, default 0.305, max 6.3

## Placement (name value [footprint] x y rotation side)
C1  2.2uF  [C0402]  30.48 69.47 180 bottom
C2  10uF  [C0402]  34.42 69.47 180 bottom
C3  4.7uF  [C0402]  17.27 74.17 90 bottom
C4  4.7uF  [C0402]  22.99 75.95 90 bottom
C5  1uF  [C0402]  51.05 47.05 180 bottom
C6  4.7uF  [C0402]  58.29 82.55 0 bottom
C7  100nF  [C0402]  58.29 81.28 0 bottom
C8  100nF  [C0402]  51.05 49.47 180 bottom
C9  1uF  [C0402]  51.05 45.85 180 bottom
C10  100nF  [C0402]  51.05 44.64 180 bottom
C11  4.7uF  [C0402]  51.05 51.94 0 bottom
C12  1uF  [C0402]  51.05 43.43 180 bottom
C13  100nF  [C0402]  50.55 71.88 180 bottom
C14  1uF  [C0402]  51.05 42.23 180 bottom
C15  1uF  [C0402]  51.05 41.02 180 bottom
C16  1uF  [C0402]  51.05 39.81 180 bottom
C17  1uF  [C0402]  51.05 38.61 180 bottom
C18  1uF  [C0402]  51.05 37.4 180 bottom
C19  1uF  [C0402]  51.05 36.19 180 bottom
C20  100nF  [C0402]  43.31 70.61 180 bottom
CN1  ZX-XH2.54-2PZZ  [CONN-TH_2P-P2.50_HX25003-2A]  11.3 72.39 180 bottom
CONFIG  TS-1088-AR02016  [SW-SMD_L3.9-W3.0-P4.45]  31.62 44.07 90 top
CONNECT  TS-1088-AR02016  [SW-SMD_L3.9-W3.0-P4.45]  31.62 51.56 90 top
D1  SS36  [DO-214AC_L5.0-W2.5-LS5.0-FD]  46.61 45.37 90 bottom
D2  SS36  [DO-214AC_L5.0-W2.5-LS5.0-FD]  46.64 38.73 90 bottom
D3  SS36  [DO-214AC_L5.0-W2.5-LS5.0-FD]  46.64 51.94 90 bottom
JP1  U.FL-R-SMT-1(80)  [RF-SMD_FRF05002-JSS103M]  73.15 87.76 90 bottom
L1  1uH  [IND-SMD_L2.0-W1.6-B]  51.05 53.97 180 bottom
LED1  KT-0603R  [LED0603-RD]  49.53 86.23 270 top
LED2  KT-0603R  [LED0603-RD]  53.47 86.23 270 top
LED3  NH-B1010RGBT-HF  [LED-ARRAY-SMD_4P-L1.0-W1.0-TR_NH-B1010RGBT]  57.78 86.36 180 top
NOREF  -  [Pad_e1318]  10.05 71.26 0 top
NOREF#2  -  [Pad_e1316]  12.57 71.25 0 top
Q1  HL2300  [SOT-23-3_L2.9-W1.3-P1.90-LS2.4-BR]  55.75 49.53 0 bottom
Q2  S8050  [SOT-23-3_L2.9-W1.6-P1.90-LS2.8-BR]  47.75 77.85 180 bottom
Q3  S8050  [SOT-23-3_L2.9-W1.6-P1.90-LS2.8-BR]  47.75 73.28 180 bottom
R1  10kΩ  [R0402]  28.78 74.85 90 bottom
R2  180Ω  [R0402]  25.91 77.72 0 bottom
R3  180Ω  [R0402]  25.91 76.33 0 bottom
R4  2.7kΩ  [R0402]  22.99 70.87 270 bottom
R5  180Ω  [R0402]  22.99 78.74 90 bottom
R6  10kΩ  [R0402]  28.78 72.64 90 bottom
R7  10kΩ  [R0402]  22.99 73.28 270 bottom
R8  10kΩ  [R0402]  50.55 70.48 180 bottom
R9  10kΩ  [R0402]  51.05 50.67 180 bottom
R10  470mΩ  [R0402]  51.05 48.26 180 bottom
R11  500Ω  [R0402]  70.56 80.19 180 bottom
R12  500Ω  [R0402]  70.56 81.45 0 bottom
R13  10kΩ  [R0402]  70.56 77.6 180 bottom
R14  500Ω  [R0402]  70.56 82.83 0 bottom
R15  10kΩ  [R0402]  70.56 78.88 180 bottom
R16  10kΩ  [R0402]  45.21 75.44 270 bottom
R17  10kΩ  [R0402]  49.91 75.46 270 bottom
SW1  K3-1296S-E1  [SW-TH_K3-1296S-E1]  11.94 87.63 270 bottom
U1  CN312  [SOT-23-6_L2.9-W1.6-P0.95-LS2.8-BL]  25.78 73.79 90 bottom
U2  BL9110-330BPFB  [SOT-223_L6.5-W3.5-P2.30-LS7.0-BR]  31.5 64.39 90 bottom
U3  LGS4084HB6  [SOT-23-6_L2.9-W1.6-P0.95-LS2.8-BL]  19.94 73.79 90 bottom
U4  FPC 0.5-24P HYH2.0  [FPC-SMD_24P-P0.50_FPC-0.5-24P-HYH2.0]  69.22 44.96 270 bottom
U5  ESP32-PICO-D4  [ESP32-PICO-D4_lengthen]  63.99 78.5 270 bottom
U6  CH340K  [ESOP-10_L4.9-W3.9-P1.00-LS6.0-BL-EP]  41.66 75.44 0 bottom
USB1  TYPE-C 16PIN 2MD(073)  [USB-C-SMD_TYPE-C-6PIN-2MD-073]  40.13 84.96 0 bottom

## Footprints (pads in the part's own frame, mm; a bottom-side part is the same pattern mirrored in y, then rotated)
C0402
  rect 0.79x0.54 smd: 1(-0.545,0) 2(0.545,0)
CONN-TH_2P-P2.50_HX25003-2A
  rect 1.8x1.8 hole 1.1: 1(-1.25,0)
  round 1.8 hole 1.1: 2(1.25,0)
DO-214AC_L5.0-W2.5-LS5.0-FD
  rect 1.8x2 smd: 1(-2.06,0) 2(2.06,0)
ESOP-10_L4.9-W3.9-P1.00-LS6.0-BL-EP
  rect 0.56x1.64 smd: 1(-2,-2.57) 2(-1,-2.57) 3(0,-2.57) 4(1,-2.57) 5(2,-2.57) 6(2,2.57) 7(1,2.57) 8(0,2.57) 9(-1,2.57) 10(-2,2.57)
  rect 3.3x2.1 smd: 11(0,0)
ESP32-PICO-D4_lengthen
  rect 1.165x0.28 smd: 1(-3.608,2.752) 2(-3.608,2.252) 3(-3.608,1.752) 4(-3.608,1.251) 5(-3.608,0.75) 6(-3.608,0.25) 7(-3.608,-0.25) 8(-3.608,-0.75) 9(-3.608,-1.251) 10(-3.608,-1.752) 11(-3.608,-2.252) 12(-3.608,-2.752) 25(3.608,-2.752) 26(3.608,-2.252) 27(3.608,-1.752) 28(3.608,-1.251) 29(3.608,-0.75) 30(3.608,-0.25) 31(3.608,0.25) 32(3.608,0.75) 33(3.608,1.251) 34(3.608,1.752) 35(3.608,2.252) 36(3.608,2.752)
  rect 0.28x1.165 smd: 13(-2.752,-3.608) 14(-2.252,-3.608) 15(-1.752,-3.608) 16(-1.251,-3.608) 17(-0.75,-3.608) 18(-0.25,-3.608) 19(0.25,-3.608) 20(0.75,-3.608) 21(1.251,-3.608) 22(1.752,-3.608) 23(2.252,-3.608) 24(2.752,-3.608) 37(2.752,3.608) 38(2.252,3.608) 39(1.752,3.608) 40(1.251,3.608) 41(0.75,3.608) 42(0.25,3.608) 43(-0.25,3.608) 44(-0.75,3.608) 45(-1.251,3.608) 46(-1.752,3.608) 47(-2.252,3.608) 48(-2.752,3.608)
  rect 5.4x5.4 smd: 49(0,0)
FPC-SMD_24P-P0.50_FPC-0.5-24P-HYH2.0
  rect 0.3x1.2 smd: 1(-5.75,1.575) 2(-5.25,1.575) 3(-4.75,1.575) 4(-4.25,1.575) 5(-3.75,1.575) 6(-3.25,1.575) 7(-2.75,1.575) 8(-2.25,1.575) 9(-1.75,1.575) 10(-1.25,1.575) 11(-0.75,1.575) 12(-0.25,1.575) 13(0.25,1.575) 14(0.75,1.575) 15(1.25,1.575) 16(1.75,1.575) 17(2.25,1.575) 18(2.75,1.575) 19(3.25,1.575) 20(3.75,1.575) 21(4.25,1.575) 22(4.75,1.575) 23(5.25,1.575) 24(5.75,1.575)
  rect 1.8x2 smd: 25(7.4,-1.575) 26(-7.4,-1.575)
IND-SMD_L2.0-W1.6-B
  rect 1x1.7 smd: 1(-0.85,0) 2(0.85,0)
LED0603-RD
  rect 0.8x0.8 smd: 1(-0.799,0) 2(0.799,0)
LED-ARRAY-SMD_4P-L1.0-W1.0-TR_NH-B1010RGBT
  rect 0.45x0.45 smd: 1(0.385,0.385) 2(0.385,-0.385) 3(-0.385,-0.385) 4(-0.385,0.385)
Pad_e1316
  rect 2.032x5.588 hole 0.914: 1(0,0)
Pad_e1318
  rect 2.032x5.588 hole 0.914: 1(0,0)
R0402
  rect 0.566x0.54 smd: 1(-0.433,0) 2(0.433,0)
RF-SMD_FRF05002-JSS103M
  rect 1x1.05 smd: 1(0,-0.762)
  rect 1.05x2.2 smd: 2(-1.475,0.762) 3(1.475,0.762)
SOT-23-3_L2.9-W1.3-P1.90-LS2.4-BR
  rect 1.25x0.7 smd: 1(1,-0.95) 2(1,0.95) 3(-1,0)
SOT-23-3_L2.9-W1.6-P1.90-LS2.8-BR
  rect 1.07x0.6 smd: 1(1.235,-0.95) 2(1.235,0.95) 3(-1.235,0)
SOT-23-6_L2.9-W1.6-P0.95-LS2.8-BL
  rect 0.532x1.072 smd: 1(-0.95,-1.149) 2(0,-1.149) 3(0.95,-1.149) 4(0.95,1.149) 5(0,1.149) 6(-0.95,1.149)
SOT-223_L6.5-W3.5-P2.30-LS7.0-BR
  rect 2.465x1.05 smd: 1(2.857,-2.3) 2(2.857,0) 3(2.857,2.3)
  rect 2.465x3.54 smd: 4(-2.857,0)
SW-SMD_L3.9-W3.0-P4.45
  rect 1.23x1.36 smd: 1(-2.185,0) 2(2.185,0)
SW-TH_K3-1296S-E1
  rect 1.25x0.9 smd: 1(1.587,-2.248) 2(1.587,-0.749) 3(1.587,2.252)
  rect 0.9x0.8 smd: 4(0.613,3.8) 5(-1.587,3.8) 6(-1.587,-3.8) 7(0.613,-3.8)
USB-C-SMD_TYPE-C-6PIN-2MD-073
  rect 0.55x1.1 smd: 1(-3.2,2.375) 2(-2.4,2.375) 11(2.4,2.375) 12(3.2,2.375)
  rect 0.3x1.1 smd: 3(-1.75,2.375) 4(-1.25,2.375) 5(-0.75,2.375) 6(-0.25,2.375) 7(0.25,2.375) 8(0.75,2.375) 9(1.25,2.375) 10(1.75,2.375)
  oval 1.2x1.8 hole 0.6x1.2: 13(-4.325,-2.375) 14(4.325,-2.375)
  oval 1.1x2 hole 0.6x1.5: 13(-4.325,1.825) 14(4.325,1.825)

## Nets
As in the schematic, except:
3V3: C1.1 C6.2 C7.2 C10.1 C11.2 C20.2 CONFIG.1 CONNECT.1 L1.1 LED3.1 R8.1 U2.2 U2.4 U4.15 U4.16 U5.1 U5.3 U5.4 U5.19 U5.37 U5.43 U5.46 U6.7 U6.10
GND: C1.2 C2.1 C3.1 C4.1 C5.2 C6.1 C7.1 C9.2 C10.2 C11.1 C12.2 C13.1 C14.2 C15.2 C16.2 C17.2 C18.2 C19.2 C20.1 CN1.1 D1.2 JP1.2 JP1.3 LED2.1 NOREF#2.1 R4.2 R7.1 R9.2 R10.2 R13.1 R15.1 U1.2 U2.1 U3.2 U4.8 U4.17 U4.25 U4.26 U5.49 U6.3 U6.11 USB1.1 USB1.12
BAT: C3.2 CN1.2 NOREF.1 SW1.2 U3.3
KEY0: CONNECT.2 R13.2 U5.22
KEY1: CONFIG.2 R15.2 U5.20

Pads without a net: SW1 3 4 5 6 7; U1 5; U3 5; U4 6 7; U5 5 6 7 8 10 11 12 13 17 18 21 24 25 26 27 28 29 30 31 32 33 44 45 47 48; U6 5; USB1 3 4 9 10 13 14

## Via types
v1: diameter 0.61, hole 0.305, Top Layer to Bottom Layer, 187 vias
v2: diameter 1.219, hole 0.61, Top Layer to Bottom Layer, 2 vias

## Routing (per net, layer and track width the routed paths; a pad name or vN(x,y) marks a point on that pad's centre or on a via; arc(x,y) is an arc through that point)
3V3: length 226.5
  Top Layer w0.254: v1(73.03,54.02) 72.98,53.97 v1(55.12,53.97) ; LED3.1 55.75,85.97 54.99,85.21 54.99,83.72 53.34,82.07 v1(53.34,80.26) v1(53.34,75.08) v1(53.34,69.73) ; 29.08,51.92 29.08,55.5 v1(35.18,61.59) 39.62,66.04 ; 29.08,51.92 29.08,44.42 CONFIG.1 ; 29.08,51.92 CONNECT.1 ; 41.53,66.04 42.67,67.18 v1(42.67,69.34) ; 41.53,66.04 51.38,66.04 53.34,68 v1(53.34,69.73) ; 41.53,66.04 39.62,66.04 ; 59.94,69.72 59.29,69.72 59.29,69.73 v1(53.34,69.73) ; 59.94,69.72 v1(66.93,69.72) 69.34,72.14 69.34,76.83 69.6,77.09 69.6,78.74 69.34,78.99 v1(68.96,78.99) ; 59.94,69.72 59.94,71.5 v1(59.82,71.63) ; v1(60.58,83.44) v1(62.74,83.44) ; 39.62,66.04 v1(39.62,71.63)
  Bottom Layer w0.254: R8.1 51.74,69.73 v1(53.34,69.73) ; U5.19 68.35,78.25 68.96,78.87 v1(68.96,78.99) ; U6.10 39.66,71.66 v1(39.62,71.63) ; v1(53.34,80.26) 53.35,80.25 58.8,80.25 ; C10.1 59.5,44.64 60.96,43.18 65.98,43.18 ; 65.98,43.18 67.61,43.18 67.64,43.21 ; 65.98,43.18 66.51,43.71 71.27,43.71 73.03,45.47 v1(73.03,54.02) 73.03,63.63 v1(66.93,69.72) ; v1(59.82,71.63) 59.18,72.26 59.18,75.18 59.75,75.75 U5.37 ; 58.8,80.25 58.8,79.25 59.3,78.75 U5.43 ; 58.8,80.25 58.8,82.68 59.56,83.44 v1(60.58,83.44) 61.24,82.78 U5.1 ; 58.8,80.25 U5.46 ; U5.4 62.74,83.44 v1(62.74,83.44) 62.24,82.94 U5.3 ; 42.67,70.7 42.66,70.72 42.66,70.98 ; 42.67,70.7 v1(42.67,69.34) ; 42.67,70.7 42.67,70.96 42.66,70.98 ; 42.67,70.7 C20.2 ; v1(55.12,53.97) L1.1 51.9,52.25 C11.2 ; v1(35.18,61.59) 31.56,61.59 U2.4 U2.2 31.5,69 C1.1 ; 42.66,70.98 U6.7
GND: length 22.8
  Bottom Layer w0.254: 69.47,42.8 69.47,42.71 67.64,42.71 ; C3.1 17.44,73.79 U3.2 ; C4.1 R7.1 24.56,73.71 U1.2 ; R10.2 50.51,48.15 C5.2 C9.2 C10.2 C12.2 C14.2 C15.2 C16.2 C17.2 C18.2 C19.2 ; 66.42,47.24 67.6,47.24 67.64,47.21 ; U6.3 U6.11
  vias: v1(3.56,88.39) v1(3.56,83.31) v1(3.56,78.23) v1(3.56,73.15) v1(3.56,17.27) v1(3.56,12.19) v1(3.56,7.11) v1(3.56,2.03) v1(7.11,71.88) v1(8.64,83.31) v1(8.64,78.23) v1(8.64,17.27) v1(8.64,12.19) v1(8.64,7.11) v1(8.64,2.03) v1(13.72,83.31) v1(13.72,78.23) v1(13.72,17.27) v1(13.72,12.19) v1(13.72,7.11) v1(13.72,2.03) v1(18.8,88.39) v1(18.8,83.31) v1(18.8,78.23) v1(18.8,17.27) v1(18.8,12.19) v1(18.8,7.11) v1(18.8,2.03) v1(23.88,83.31) v1(23.88,17.27) v1(23.88,12.19) v1(23.88,7.11) v1(23.88,2.03) v1(28.96,83.31) v1(28.96,78.23) v1(28.96,62.99) v1(28.96,57.91) v1(28.96,42.67) v1(28.96,37.59) v1(28.96,32.51) v1(28.96,27.43) v1(28.96,22.35) v1(28.96,17.27) v1(28.96,12.19) v1(28.96,7.11) v1(28.96,2.03) v1(34.04,62.99) v1(34.04,57.91) v1(34.04,52.83) v1(34.04,47.75) v1(34.04,42.67) v1(34.04,37.59) v1(34.04,32.51) v1(34.04,27.43) v1(34.04,22.35) v1(34.04,17.27) v1(34.04,12.19) v1(34.04,7.11) v1(34.04,2.03) v1(39.12,62.99) v1(39.12,57.91) v1(39.12,52.83) v1(39.12,47.75) v1(39.12,42.67) v1(39.12,37.59) v1(39.12,32.51) v1(39.12,27.43) v1(39.12,22.35) v1(39.12,17.27) v1(39.12,12.19) v1(39.12,7.11) v1(39.12,2.03) v1(44.2,68.07) v1(44.2,62.99) v1(44.2,57.91) v1(44.2,52.83) v1(44.2,47.75) v1(44.2,42.67) v1(44.2,37.59) v1(44.2,32.51) v1(44.2,27.43) v1(44.2,22.35) v1(44.2,17.27) v1(44.2,12.19) v1(44.2,7.11) v1(44.2,2.03) v1(49.28,83.31) v1(49.28,68.07) v1(49.28,62.99) v1(49.28,57.91) v1(49.28,27.43) v1(49.28,22.35) v1(49.28,17.27) v1(49.28,12.19) v1(49.28,7.11) v1(49.28,2.03) v1(49.53,51.05) v1(54.36,88.39) v1(54.36,68.07) v1(54.36,62.99) v1(54.36,57.91) v1(54.36,27.43) v1(54.36,22.35) v1(54.36,17.27) v1(54.36,12.19) v1(54.36,7.11) v1(54.36,2.03) v1(59.31,28.07) v1(59.44,88.39) v1(59.44,32.51) v1(59.44,22.35) v1(59.44,17.27) v1(59.44,12.19) v1(59.44,7.11) v1(59.44,2.03) v1(64.52,88.39) v1(64.52,37.59) v1(64.52,32.51) v1(64.52,27.43) v1(64.52,22.35) v1(64.52,17.27) v1(64.52,12.19) v1(64.52,7.11) v1(64.52,2.03) v1(69.6,88.39) v1(69.6,32.51) v1(69.6,27.43) v1(69.6,22.35) v1(69.6,17.27) v1(69.6,12.19) v1(69.6,7.11) v1(69.6,2.03) v1(74.68,83.31) v1(74.68,78.23) v1(74.68,37.59) v1(74.68,32.51) v1(74.68,27.43) v1(74.68,22.35) v1(74.68,17.27) v1(74.68,12.19) v1(74.68,7.11) v1(74.68,2.03)
BAT: length 23.5
  Bottom Layer w0.508: U3.3 18.77,74.71 C3.2 10.05,74.71 ; SW1.2 12.69,83.88 10.05,81.25 10.05,74.71 ; 10.05,74.71 CN1.2
BAT_OUT: length 46.1
  Top Layer w0.508: v2(33.78,82.55) v2(33.78,77.98)
  Bottom Layer w0.508: 33.8,67.25 33.8,77.96 v2(33.78,77.98) 33.78,76.48 32.59,75.29 28.17,75.29 27.62,74.74 U1.4 ; v2(33.78,82.55) 32.26,84.07 14.99,84.07 14.22,84.84 14.22,86 SW1.1
DTR: length 10.7
  Bottom Layer w0.254: U6.4 42.66,78.85 43.31,79.5 44.58,79.5 45.21,78.87 46.45,78.87 Q2.2 47.06,78.8 47.75,78.1 47.75,76.71 48.57,75.89 49.91,75.89
ESP_EN: length 28
  Top Layer w0.254: v1(55.25,73.28) 59.69,73.28 61.72,75.31 61.72,81.28 63.88,83.44 v1(64.01,83.44)
  Bottom Layer w0.254: 49.99,70.48 50,70.5 50,73.28 ; 50,73.28 v1(55.25,73.28) ; 50,73.28 Q3.3 ; U5.9 65.24,83.25 65.06,83.44 v1(64.01,83.44)
ESP_IO0: length 28.8
  Top Layer w0.254: v1(53.97,77.85) 54.48,77.34 54.48,73.02 55.04,72.47 68.15,72.47 68.71,73.02 v1(68.71,75.31)
  Bottom Layer w0.254: v1(68.71,75.31) 68.71,75.82 68.28,76.25 U5.23 ; v1(53.97,77.85) Q2.3
GDR: length 16.6
  Top Layer w0.254: v1(65.41,50.93) 58.29,50.93 v1(58.04,50.67)
  Bottom Layer w0.254: v1(58.04,50.67) R9.1 ; 67.64,50.21 66.12,50.21 v1(65.41,50.93)
KEY0: length 58.8
  Top Layer w0.254: CONNECT.2 31.62,54.36 34.42,57.15 62.48,57.15 70.1,64.77 v1(70.1,76.71)
  Bottom Layer w0.254: U5.22 68.75,76.75 68.79,76.71 v1(70.1,76.71) 70.13,76.73 R13.2
KEY1: length 70.2
  Top Layer w0.254: v1(72.52,76.71) 72.52,66.29 62.74,56.52 37.72,56.52 34.93,53.72 34.93,49.56 31.62,46.25
  Bottom Layer w0.254: v1(72.52,76.71) 72.52,78.61 71.63,79.5 70.3,79.5 70.13,79.33 R15.2 69,77.75 U5.20
LED_B: length 3.9
  Bottom Layer w0.254: U5.14 68.43,80.75 69.09,81.41 69.09,82.3 69.62,82.83 R14.1
LED_G: length 3
  Bottom Layer w0.254: U5.15 68.82,80.25 70.02,81.45 R12.1
LED_R: length 2.7
  Bottom Layer w0.254: U5.16 69.21,79.75 69.62,80.16 70.13,80.16
PREVGH: length 36.4
  Top Layer w0.254: v1(48.51,45.85) 48.51,41.02 49.78,39.75 v1(54.45,39.75)
  Bottom Layer w0.254: v1(48.51,45.85) 48.51,52.89 47.4,54 ; 67.64,40.71 61.92,40.71 60.96,39.75 v1(54.45,39.75) 51.66,39.75 C16.1
PREVGL: length 28.1
  Top Layer w0.254: v1(54.46,37.47) 54.46,37.31 51.56,34.42 47.24,34.42 v1(46.61,35.05)
  Bottom Layer w0.254: C18.1 51.66,37.47 v1(54.46,37.47) 62.1,37.47 64.35,39.71 67.64,39.71 ; v1(46.61,35.05) 46.61,36.65 D2.1
RESE: length 17
  Top Layer w0.254: v1(65.41,50.04) 59.82,50.04 v1(58.04,48.26)
  Bottom Layer w0.254: v1(65.41,50.04) 65.74,49.71 67.64,49.71 ; v1(58.04,48.26) R10.1
RTS: length 5.2
  Bottom Layer w0.254: U6.6 43.66,74.26 44.32,74.93 45.14,74.93 R16.2 45.21,74.55 45.59,74.17 46.46,74.17 Q3.2
SCR_BUSY: length 32
  Bottom Layer w0.254: 67.64,46.71 67.61,46.74 64.9,46.74 62.24,49.39 U5.34
SCR_CLK: length 39.5
  Bottom Layer w0.254: U5.39 58.97,76.75 58.29,76.07 58.29,69.34 60.2,67.44 60.2,48.89 64.38,44.71 67.64,44.71
SCR_CS: length 50.2
  Bottom Layer w0.254: U5.38 59.37,76.25 58.8,75.68 58.8,69.72 60.73,67.79 60.73,48.99 64.51,45.21 70.74,45.21 71.5,45.97 71.5,50.16 70.96,50.71 67.64,50.71
SCR_DC: length 33.6
  Bottom Layer w0.254: U5.36 61.21,74.87 61.21,49.14 64.64,45.71 67.64,45.71
SCR_MOSI: length 44.9
  Top Layer w0.254: v1(58.93,66.93) 58.04,66.93 56.13,68.83 v1(56.13,68.96)
  Bottom Layer w0.254: 67.64,44.21 67.63,44.2 64.26,44.2 59.69,48.77 59.69,66.17 v1(58.93,66.93) ; v1(56.13,68.96) 56.13,77.09 57.3,78.25 U5.42
SCR_RST: length 32.8
  Bottom Layer w0.254: U5.35 61.72,74.88 61.72,49.28 64.79,46.21 67.64,46.21
SER_RX: length 37.4
  Bottom Layer w0.254: U5.40 58.58,77.25 56.85,75.52 56.85,65.36 56.26,64.77 42.67,64.77 41.66,65.79 U6.8
SER_TX: length 41.4
  Top Layer w0.254: v1(57.15,77.09) 57.15,75.82 57.53,75.44 v1(57.53,73.9)
  Bottom Layer w0.254: v1(57.15,77.09) 57.81,77.75 U5.41 ; v1(57.53,73.9) 57.53,64.64 56.9,64.01 41.83,64.01 40.66,65.18 U6.9
TYPE_5V: length 34.8
  Bottom Layer w0.508: U3.4 21.84,75.49 21.84,76.21 22.12,76.49 C4.2 R5.1 23.56,78.31 25.39,80.14 36.45,80.14 37.72,81.41 37.72,82.58 USB1.2 37.73,83.26 37.99,83.52 37.99,86.28 38.95,87.25 41.31,87.25 42.28,86.28 42.28,83.52 42.53,83.26 USB1.11
USB_D+: length 13.7
  Top Layer w0.254: v1(39.62,85.35) 39.62,85.86 40.13,86.36 40.89,86.36 41.4,85.86 v1(41.4,84.33)
  Bottom Layer w0.254: v1(41.4,84.33) 40.88,83.81 40.88,82.59 ; U6.1 39.62,78.04 39.62,80.64 39.88,80.9 USB1.6 ; 39.88,82.59 39.88,85.09 v1(39.62,85.35)
USB_D-: length 13.7
  Top Layer w0.254: v1(38.86,84.33) v1(38.86,85.86)
  Bottom Layer w0.254: USB1.5 39.38,83.81 v1(38.86,84.33) ; U6.2 40.64,78.02 40.64,80.64 40.38,80.9 USB1.7 ; v1(38.86,85.86) 39.37,86.36 40.13,86.36 40.64,85.86 40.64,85.35 40.38,85.09 40.38,82.59
$1N863: length 14.7
  Bottom Layer w0.254: U5.2 61.74,85.11 64.26,87.63 72.26,87.63 JP1.1
$1N884: length 5.1
  Bottom Layer w0.254: R17.2 49.88,75.06 48.77,75.06 47.75,74.04 47.75,73.15 46.93,72.33 Q3.1
$1N885: length 2.1
  Bottom Layer w0.254: R16.1 45.21,76.45 45.66,76.9 Q2.1
$1N1862: length 37.5
  Top Layer w0.254: LED1.2 48.42,85.43 47.57,86.29 47.57,87.9 46.7,88.77 24.64,88.77 22.99,87.12 v1(22.99,81.03)
  Bottom Layer w0.254: v1(22.99,81.03) R5.2
$1N1863: length 46
  Top Layer w0.254: v1(20.07,77.09) 21.93,78.95 21.93,86.82 24.38,89.28 48.42,89.28 49.53,88.18 LED1.1
  Bottom Layer w0.254: U3.1 19.62,72.84 20.07,73.28 v1(20.07,77.09)
$1N1867: length 3
  Bottom Layer w0.254: U3.6 21.65,72.84 22.1,72.39 22.1,71.63 22.43,71.3 R4.1
$1N7637: length 1.3
  Bottom Layer w0.254: R1.1 R6.2
$1N7673: length 6.1
  Bottom Layer w0.254: R6.1 28.7,72.14 28.19,72.14 27.49,72.84 U1.6 U1.1 24.62,72.85 R7.2
$1N7798: length 39
  Top Layer w0.254: v1(26.34,78.87) 26.34,83.62 28.7,85.98 36.32,85.98 38.48,88.14 41.78,88.14 45.85,84.07 52.72,84.07 53.47,84.82 53.47,85.18 53.72,85.43
  Bottom Layer w0.254: R3.2 R2.2 v1(26.34,78.87)
$1N7808: length 3.7
  Bottom Layer w0.254: R2.1 25.53,77.67 25.53,75.06 25.21,74.74 U1.3
$1N8395: length 16.9
  Top Layer w0.254: v1(58.04,47.12) 60.13,49.21 v1(65.41,49.21)
  Bottom Layer w0.254: v1(58.04,47.12) 51.66,47.12 C5.1 ; v1(65.41,49.21) 67.64,49.21
$1N8399: length 17.2
  Top Layer w0.254: v1(65.41,48.39) 60.58,48.39 v1(58.04,45.85)
  Bottom Layer w0.254: v1(58.04,45.85) C9.1 ; v1(65.41,48.39) 65.73,48.71 67.64,48.71
$1N8887: length 16.8
  Bottom Layer w0.254: 52.07,36.19 62.09,36.19 65.1,39.21 67.64,39.21
$1N8895: length 16.5
  Bottom Layer w0.254: C12.1 59.54,43.43 60.77,42.21 67.64,42.21
$1N8900: length 16.3
  Bottom Layer w0.254: C14.1 51.66,42.16 59.82,42.16 60.27,41.71 67.64,41.71
$1N8928: length 16.2
  Bottom Layer w0.254: C15.1 51.73,40.89 60.71,40.89 61.02,41.21 67.64,41.21
$1N8950: length 16.7
  Bottom Layer w0.254: C17.1 61.59,38.61 63.19,40.21 67.64,40.21
$1N9134: length 12.2
  Bottom Layer w0.254: D2.2 46.61,40.82 D1.1 48.9,43.31 49.15,43.56 49.15,49.02 49.53,49.4 50.45,49.4 C8.2
$1N9218: length 35.6
  Bottom Layer w0.254: C8.1 53.42,49.47 53.48,49.53 Q1.3 58.04,49.53 58.8,50.29 58.8,54.48 57.66,55.63 51.35,55.63 51.09,55.37 51.09,54.48 50.59,53.97 L1.2 49.53,53.97 49.15,54.36 49.15,55.24 48.77,55.63 45.21,55.63 44.96,55.37 44.96,50.16 45.24,49.88 D3.1
$1N9685: length 24.4
  Top Layer w0.254: v1(72.14,80.14) 73.66,81.66 73.66,84.2 72.26,85.6 60.58,85.6 59.94,86.23 59.94,86.87 59.31,87.5 57.76,87.5 57.4,87.15 LED3.2
  Bottom Layer w0.254: v1(72.14,80.14) 72.08,80.19 R11.1
$1N9687: length 17.4
  Top Layer w0.254: v1(72.14,82.8) 72.14,83.69 71.63,84.2 59.12,84.2 58.17,85.15 LED3.4
  Bottom Layer w0.254: v1(72.14,82.8) 72.11,82.83 R14.2
$1N9689: length 20.4
  Top Layer w0.254: LED3.3 58.95,86.74 59.21,86.49 59.21,85.47 59.84,84.84 71.88,84.84 72.9,83.82 72.9,82.17 v1(72.14,81.41)
  Bottom Layer w0.254: R12.2 72.1,81.45 v1(72.14,81.41)

## Copper pours and planes (outline as drawn; the poured copper is in the pictures)
GND on Top Layer: -2.41,93.73 80.26,93.73 80.26,-7.11 -2.41,-7.11
GND on Bottom Layer: -1.4,91.44 82.17,91.44 82.17,-5.08 -1.4,-5.08

## Text on the board
Bottom Silkscreen Layer: Artisan's | Tome
